# Altium schematic sheet 02_boost3v3D.SchDoc
size A; SheetNumber: 8; SheetTotal: 17
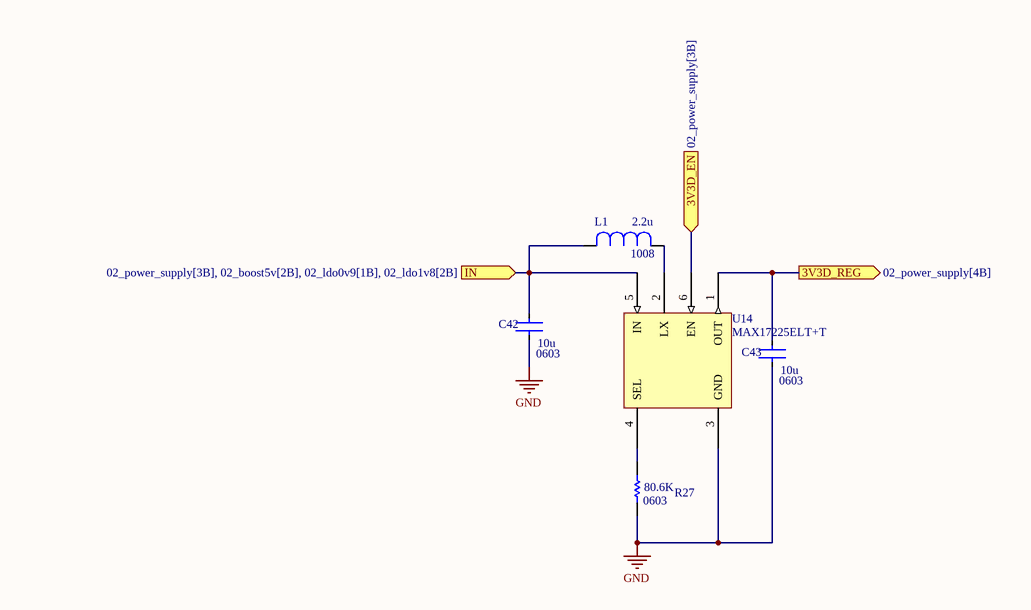
[diagram p0: 02_boost3v3D.SchDoc]

## Parts
C42  C1608X5R1A106K080AC  [CAPTDK0603]  (value not drawn)
C43  C1608X5R1A106K080AC  [CAPTDK0603]  (value not drawn)
L1  DFE252012P-2R2M=P2  [INDMURT1008]  (value not drawn)
R27  RMCF0603FT80K6  [RES-STACK-POLE-0603]  (value not drawn)
U14  MAX17225ELT+T  [MAX17222ELT+T]

## Ports
3V3D_EN (in, see 02_power_supply[3B]), 3V3D_REG (out, see 02_power_supply[4B]), IN (in, see 02_power_supply[3B], 02_boost5v[2B], 02_ldo0v9[1B], 02_ldo1v8[2B])

## Nets
GND: C42.2 C43.2 R27.1 U14.3(GND)
3V3D_EN: U14.6(EN) ; port 3V3D_EN
3V3D_REG: C43.1 U14.1(OUT) ; port 3V3D_REG
IN: C42.1 L1.2 U14.5(IN) ; port IN
NetL1_1: L1.1 U14.2(LX)
NetR27_2: R27.2 U14.4(SEL)

## Notes on the sheet
- (in symbol C1608X5R1A106K080AC) 10u; 0603
- (in symbol DFE252012P-2R2M=P2) 2.2u; 1008
- (in symbol RMCF0603FT80K6) 80.6K; 0603

## Library data of the parts
C42 C43 = C1608X5R1A106K080AC: CAP CER 10UF 10V X5R 0603; Supplier 1: Digi-Key; Supplier Part Number 1: 445-C1608X5R1A106K080ACCT-ND
L1 = DFE252012P-2R2M=P2: FIXED IND 2.2UH 2.2A 84 MOHM SMD; Mfr_Name: Murata; Type: DEV; Copyright: Copyright (C) 2022 Ultra Librarian. All rights reserved.; Manufacturer_Part_Number: DFE252012P-2R2M=P2; Digi-Key_Part_Number_1: 490-10649-1-ND; Digi-Key_Part_Number_2: 490-10649-2-ND; Digi-Key_Part_Number_3: 490-10649-6-ND; RefDes: RefDes; Supplier 1: Digi-Key; Supplier Part Number 1: 490-10649-1-ND
R27 = RMCF0603FT80K6: RES 80.6K OHM 1% 1/10W 0603; Mfr_Name: Stackpole International; Copyright: Copyright (C) 2022 Ultra Librarian. All rights reserved.; Manufacturer_Part_Number: RMCF0603FT80K6; Digi-Key_Part_Number_1: RMCF0603FT80K6CT-ND; Digi-Key_Part_Number_2: RMCF0603FT80K6DKR-ND; Digi-Key_Part_Number_3: RMCF0603FT80K6TR-ND; RefDes: RefDes; Type: DEV; Supplier 1: Digi-Key; Supplier Part Number 1: RMCF0603FT80K6CT-ND
U14 = MAX17225ELT+T: IC REG 0.9V TO 5V 1A 6UDFN; Mfr_Name: Maxim Integrated Products; Copyright: Copyright (C) 2022 Ultra Librarian. All rights reserved.; Manufacturer_Part_Number: MAX17225ELT+T; Digi-Key_Part_Number_1: MAX17225ELT+TTR-ND; Digi-Key_Part_Number_2: MAX17225ELT+TCT-ND; Digi-Key_Part_Number_3: MAX17225ELT+TDKR-ND; RefDes: RefDes; Type: DEV; Supplier 1: Mouser; Supplier Part Number 1: 700-MAX17225ELT+T